# EasyEDA Pro project ActiveMoCapDeck_80mm.eprj

# Schematic ActivaMoCapDeck
Board Name: ActiveMoCapDeck; Create Date: 2024-12-02; Page Name: sch_1; Project Name: ActiveMoCapDeck_10mm; Schematic Name: ActivaMoCapDeck; Update Date: 2024-12-02; Comment1: Licensed under CC-BY 4.0; Comp: Bitcraze AB; Date: 20 okt 2014; File: template; Id: 1/1; Rev: A; Sheet: /; Title: Crazyflie 2.0 expansion boad template
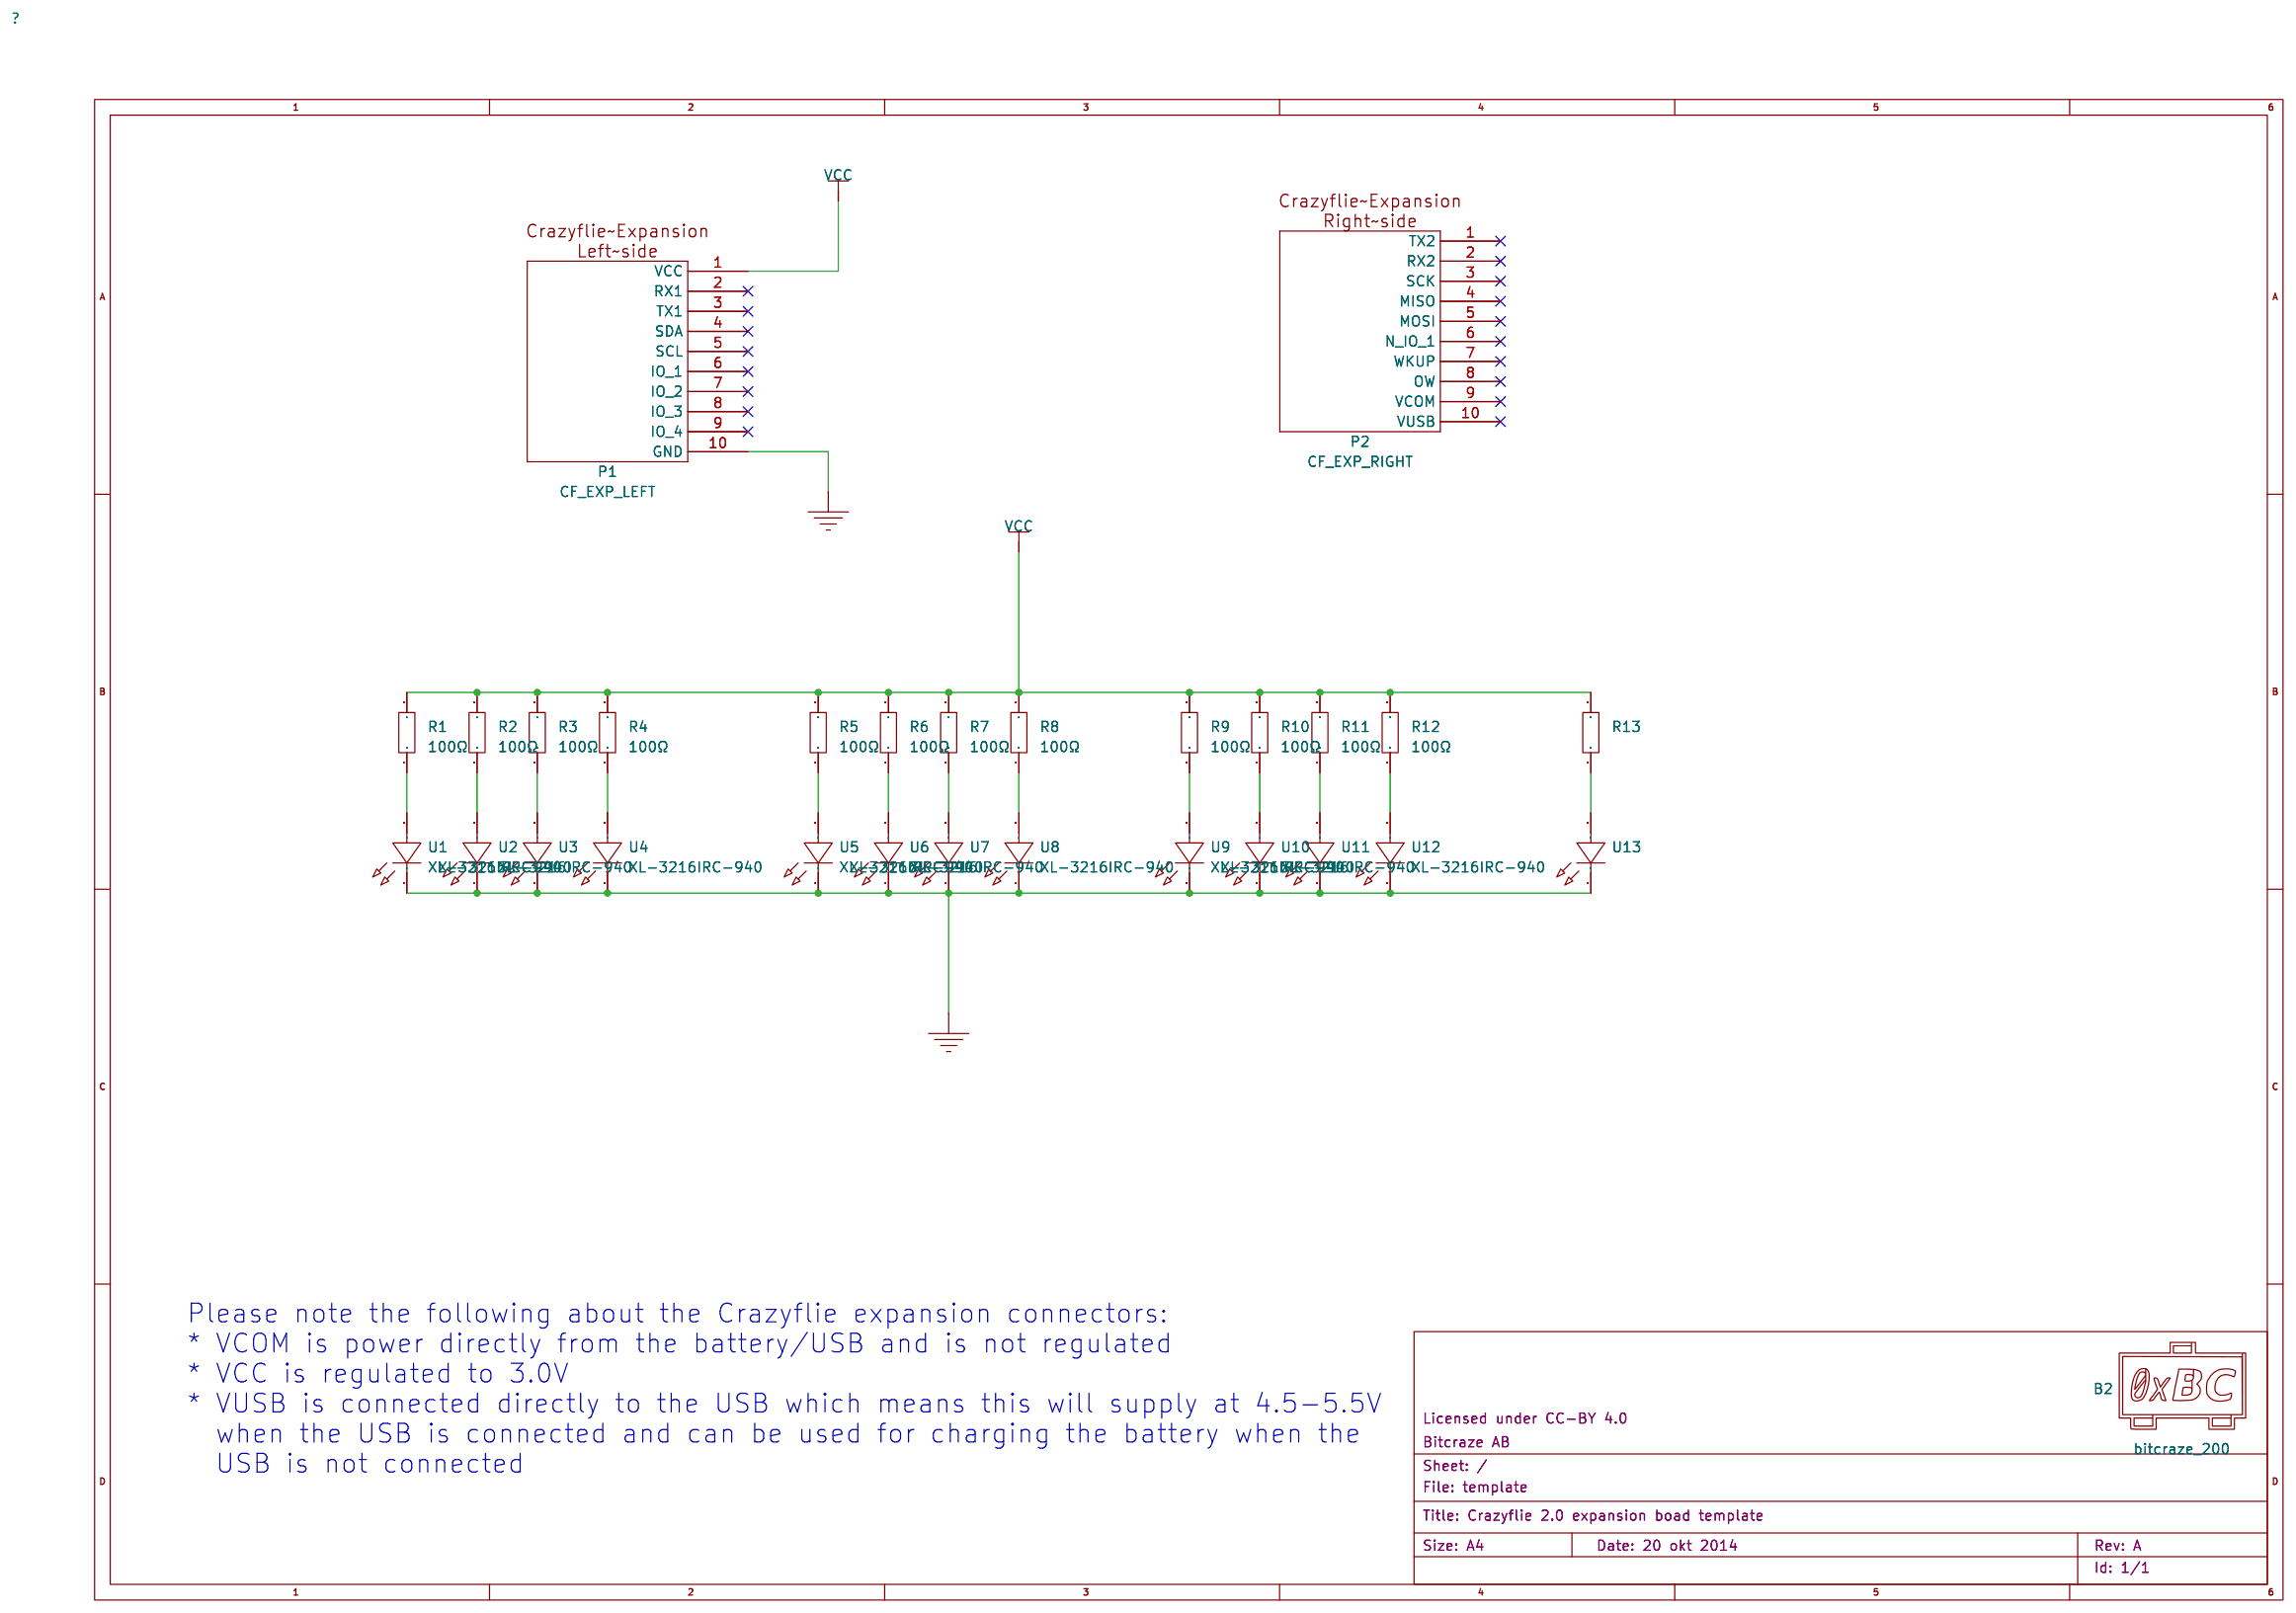
[diagram p0: schematic sheet]

## Parts
B2  bitcraze_200  [bitcraze:EXP_ORIENTATION]
P1  CF_EXP_LEFT  [connectors:BF090-10-X-B2]
P2  CF_EXP_RIGHT  [connectors:BF090-10-X-B2]
R1  100Ω  [R1206]
R2  100Ω  [R1206]
R3  100Ω  [R1206]
R4  100Ω  [R1206]
R5  100Ω  [R1206]
R6  100Ω  [R1206]
R7  100Ω  [R1206]
R8  100Ω  [R1206]
R9  100Ω  [R1206]
R10  100Ω  [R1206]
R11  100Ω  [R1206]
R12  100Ω  [R1206]
R13  100Ω  [R1206]
U1  XL-3216IRC-940  [LED1206-RD]
U2  XL-3216IRC-940  [LED1206-RD]
U3  XL-3216IRC-940  [LED1206-RD]
U4  XL-3216IRC-940  [LED1206-RD]
U5  XL-3216IRC-940  [LED1206-RD]
U6  XL-3216IRC-940  [LED1206-RD]
U7  XL-3216IRC-940  [LED1206-RD]
U8  XL-3216IRC-940  [LED1206-RD]
U9  XL-3216IRC-940  [LED1206-RD]
U10  XL-3216IRC-940  [LED1206-RD]
U11  XL-3216IRC-940  [LED1206-RD]
U12  XL-3216IRC-940  [LED1206-RD]
U13  XL-3216IRC-940  [LED1206-RD]

## Library data of the parts
B2 = bitcraze_200: Check: false
P1 = CF_EXP_LEFT: Library Name: *; Check: false
P2 = CF_EXP_RIGHT: Library Name: *; Check: false
R1-R13 = 1206W4F1000T5E: 电阻类型:厚膜电阻;阻值:100Ω;精度:±1%;功率:250mW;最大工作电压:200V;温度系数:±100ppm/℃;; LCSC Part Name: 100Ω ±1% 250mW 厚膜电阻; Supplier Part: C17901; Manufacturer: UNI-ROYAL(厚声); Supplier Footprint: 1206; JLCPCB Part Class: 基础库; Datasheet: https://atta.szlcsc.com/upload/public/pdf/source/20200306/C422600_1E6D84923E4A46A82E41ADD87F860B5C.pdf; Supplier: LCSC; Type: 厚膜电阻; Tolerance: ±1%; Power(Watts): 250mW; Overload Voltage (Max): 200V; Temperature Coefficient: ±100ppm/℃; Operating Temperature Range: -55℃~+155℃
U1-U13 = XL-3216IRC-940: 正向电压:1.2V~1.6V;耗散功率:70mW;波长:939nm~946nm;辐射强度:-;正向电流-DC (If):30mA;直流反向耐压:5V;视角:120°;; LCSC Part Name: 940nm 30mA红外发射; Supplier Part: C965892; Manufacturer: XINGLIGHT(成兴光); Supplier Footprint: 1206; JLCPCB Part Class: 扩展库; Datasheet: https://atta.szlcsc.com/upload/public/pdf/source/20240218/C8A2B9DDF9B3730036042A306FEBA0C2.pdf; Supplier: LCSC; Vf - Forward Voltage: 1.2V~1.6V; Power Dissipation: 70mW; Wavelength: 939nm~946nm; Current - DC Forward (If): 30mA; Reverse Voltage: 5V; View Angle: 120°; Operating Temperature: -30℃~+85℃

## Nets
GND: P1.10(GND) U1.1(K) U2.1(K) U3.1(K) U4.1(K) U5.1(K) U6.1(K) U7.1(K) U8.1(K) U9.1(K) U10.1(K) U11.1(K) U12.1(K) U13.1(K)
VCC: P1.1(VCC) R1.2 R2.2 R3.2 R4.2 R5.2 R6.2 R7.2 R8.2 R9.2 R10.2 R11.2 R12.2 R13.2
$3N18323: R1.1 U1.2(A)
$3N18400: R2.1 U2.2(A)
$3N18477: R3.1 U3.2(A)
$3N18554: R4.1 U4.2(A)
$3N18856: R5.1 U5.2(A)
$3N18858: R6.1 U6.2(A)
$3N18860: R7.1 U7.2(A)
$3N18862: R8.1 U8.2(A)
$3N19164: R9.1 U9.2(A)
$3N19166: R10.1 U10.2(A)
$3N19168: R11.1 U11.2(A)
$3N19170: R12.1 U12.2(A)
$3N19472: R13.1 U13.2(A)

Not connected (* = marked no-connect by the designer): P1 2(RX1)* 3(TX1)* 4(SDA)* 5(SCL)* 6(IO_1)* 7(IO_2)* 8(IO_3)* 9(IO_4)*; P2 1(TX2)* 2(RX2)* 3(SCK)* 4(MISO)* 5(MOSI)* 6(N_IO_1)* 7(WKUP)* 8(OW)* 9(VCOM)* 10(VUSB)*

## Notes on the sheet
- Please note the following about the Crazyflie expansion connectors:
  * VCOM is power directly from the battery/USB and is not regulated
  * VCC is regulated to 3.0V
  * VUSB is connected directly to the USB which means this will supply at 4.5-5.5V
    when the USB is connected and can be used for charging the battery when the
    USB is not connected

# Board pcb
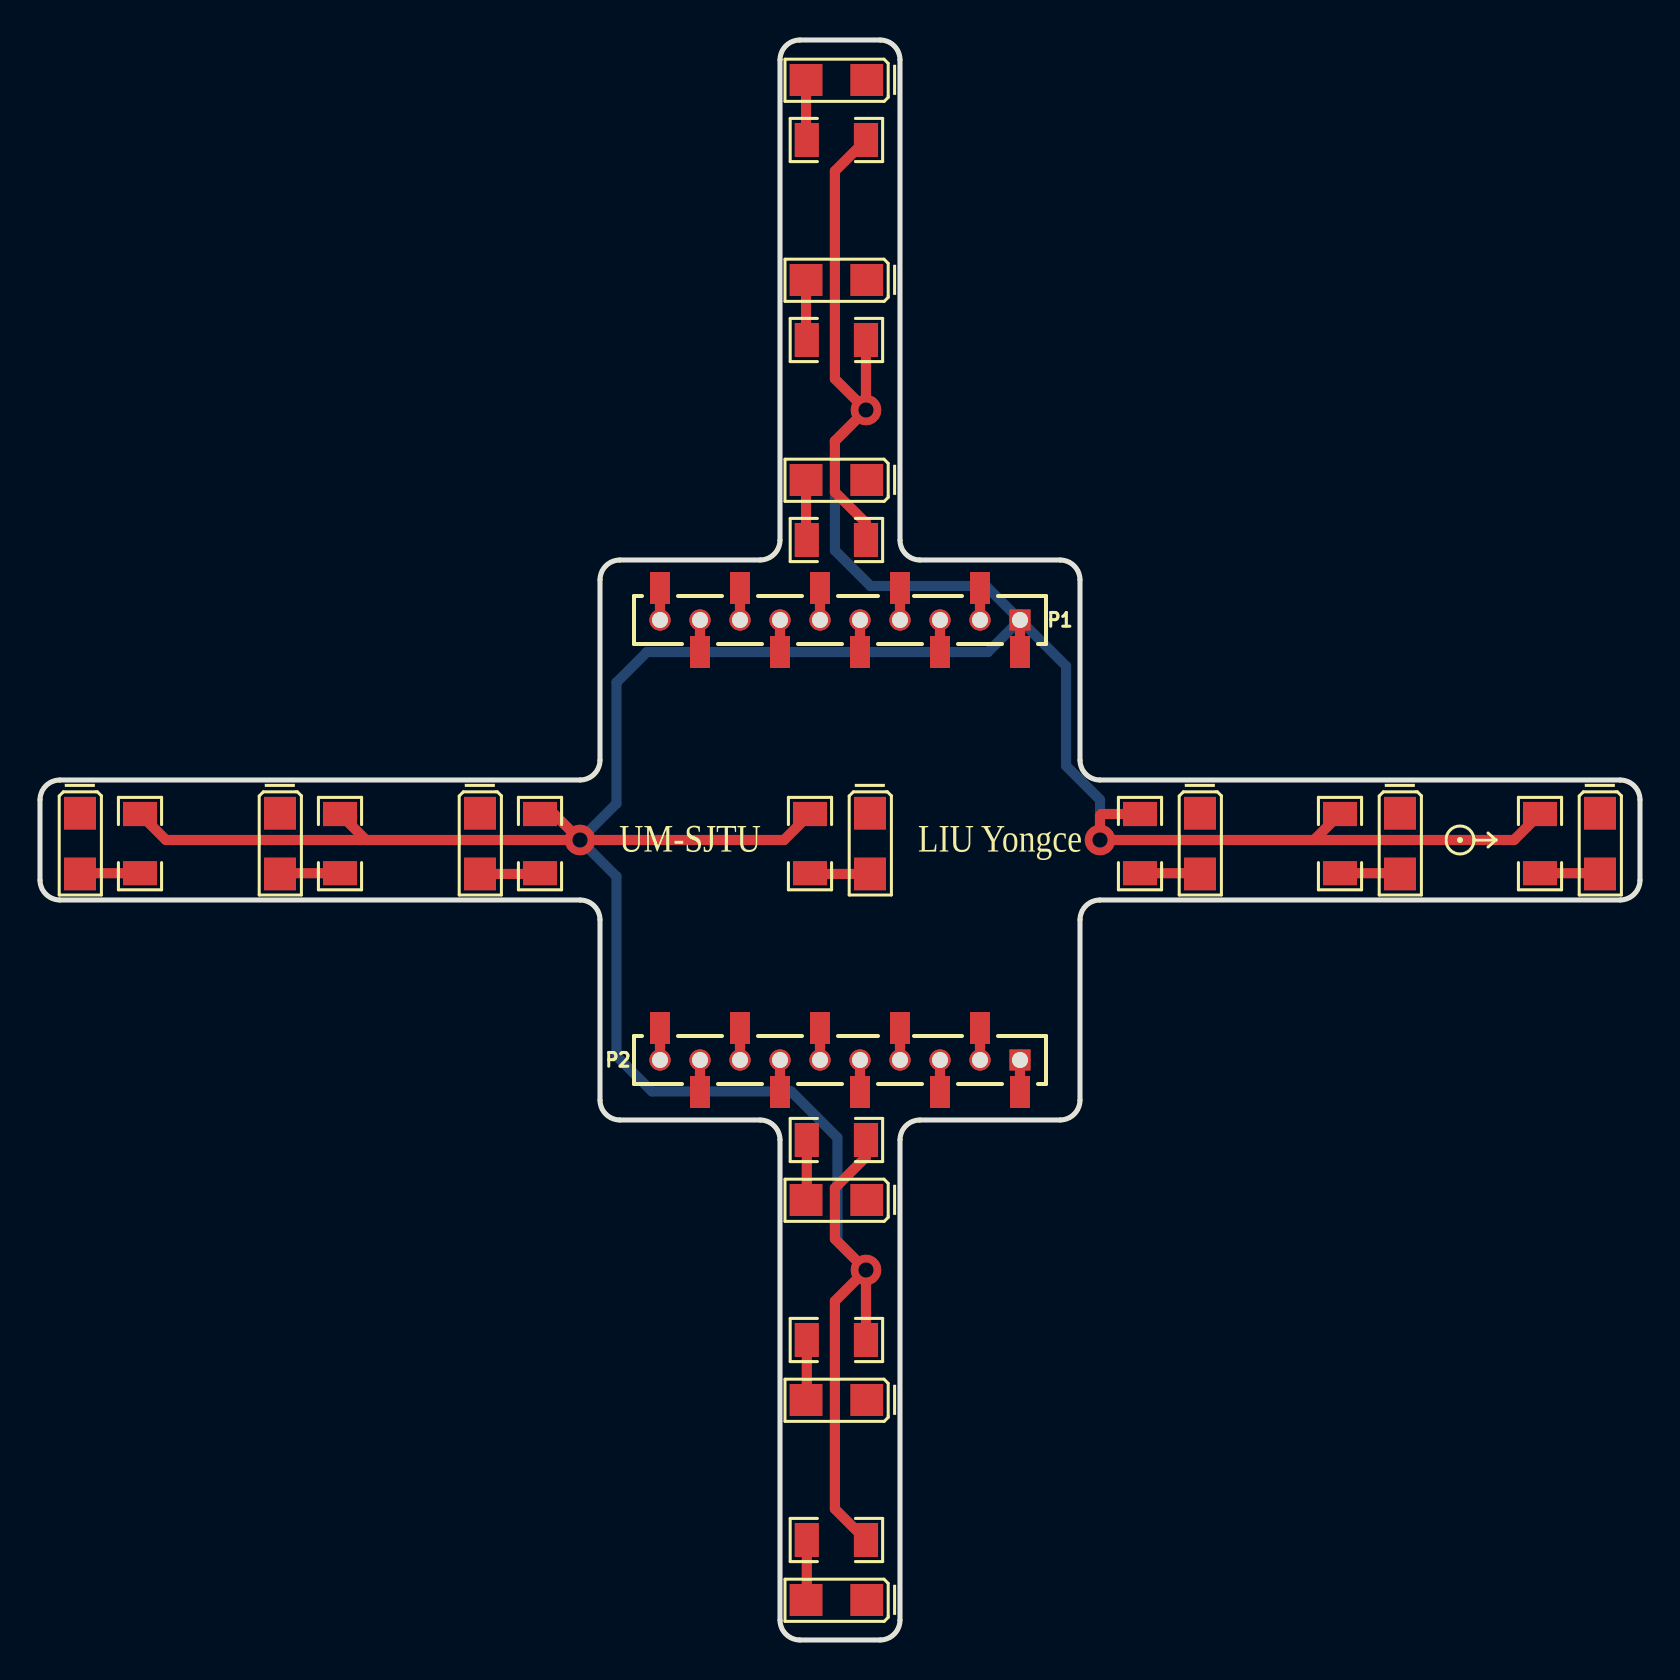
[diagram p1: board, top side]
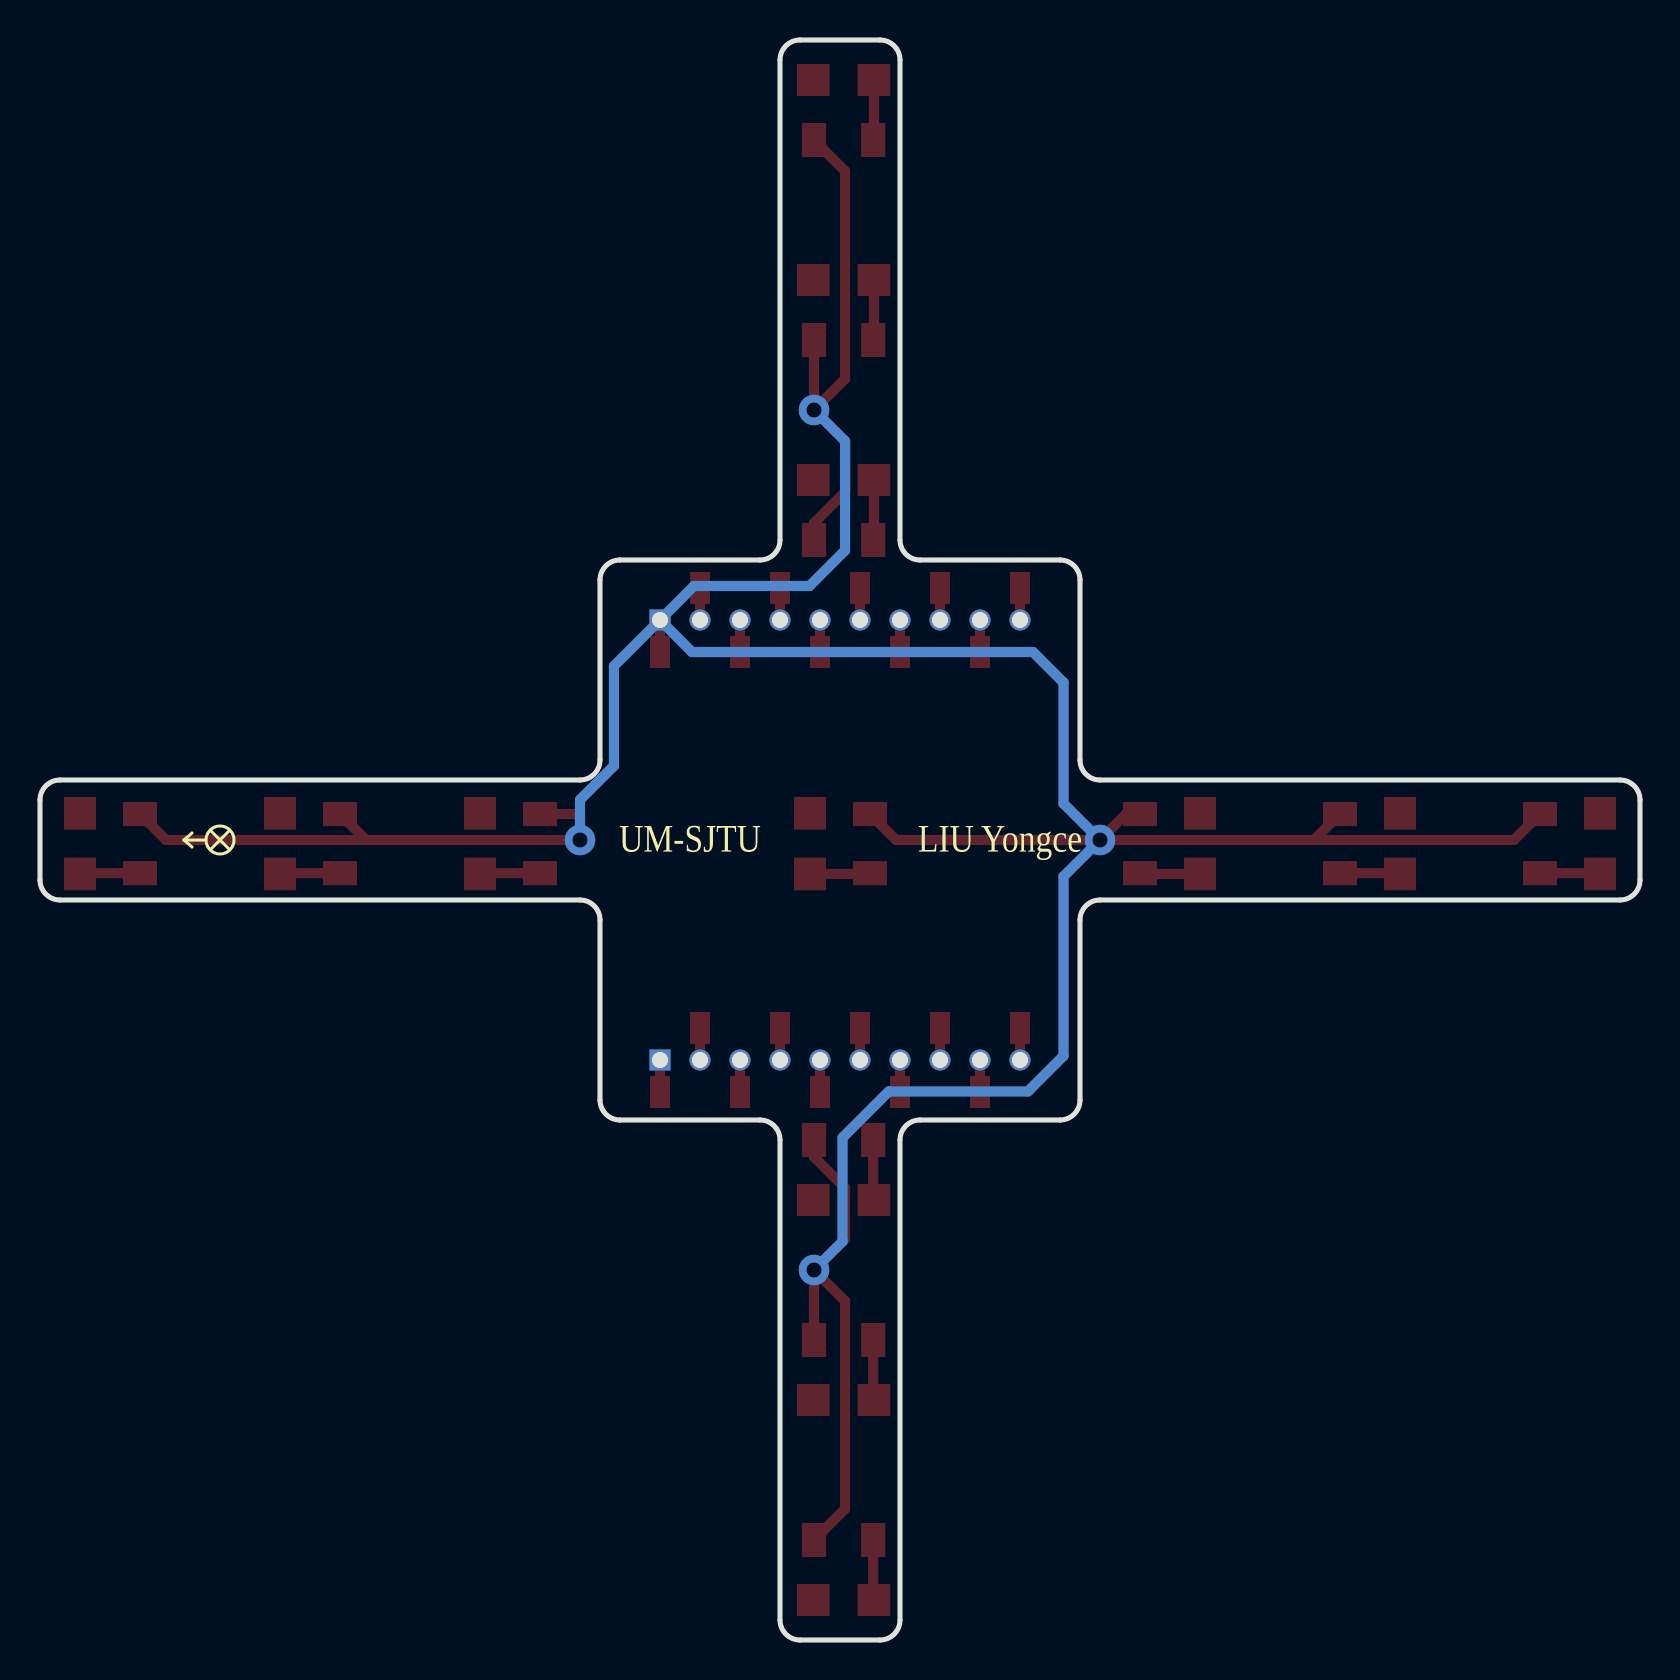
[diagram p2: board, bottom side, seen from below]

Outline 80 x 80 mm; copper layers: Top Layer, Bottom Layer. Coordinates in mm from the lower left corner of the outline.
Outline path: 0,42 arc(0.29,42.71) 1,43 27,43 arc(27.71,43.29) 28,44 28,53 arc(28.29,53.71) 29,54 36,54 arc(36.71,54.29) 37,55 37,79 arc(37.29,79.71) 38,80 42,80 arc(42.71,79.71) 43,79 43,55 arc(43.29,54.29) 44,54 51,54 arc(51.71,53.71) 52,53 52,44 arc(52.29,43.29) 53,43 79,43 arc(79.71,42.71) 80,42 80,38 arc(79.71,37.29) 79,37 53,37 arc(52.29,36.71) 52,36 52,27 arc(51.71,26.29) 51,26 44,26 arc(43.29,25.71) 43,25 43,1 arc(42.71,0.29) 42,0 38,0 arc(37.29,0.29) 37,1 37,25 arc(36.71,25.71) 36,26 29,26 arc(28.29,26.29) 28,27 28,36 arc(27.71,36.71) 27,37 1,37 arc(0.29,37.29) 0,38 0,42
Stack: Top Layer 0.035mm / Dielectric1 1.51mm FR4 er 4.5 / Bottom Layer 0.035mm

## Design rules (mm)
spacing Default (default): track to track 0.152, other pairs 0 to 0.152
track width Default (default): min 0.203, default 0.203, max 2.54
differential pair Default (default): width min 0, default 0, max 2.54; gap min 0, default 0
via Default (default): diameter min 0.635, default 0.635, max 10.003; hole min 0.381, default 0.381, max 5.999

## Placement (name value [footprint] x y rotation side)
B2  bitcraze_200  [bitcraze:EXP_ORIENTATION]  71 40 0 top
P1  CF_EXP_LEFT  [connectors:BF090-10-X-B2]  40 51 180 top
P2  CF_EXP_RIGHT  [connectors:BF090-10-X-B2]  40 29 180 top
R1  100Ω  [R1206]  75 39.82 90 top
R2  100Ω  [R1206]  65 39.82 90 top
R3  100Ω  [R1206]  55 39.82 90 top
R4  100Ω  [R1206]  39.82 5 0 top
R5  100Ω  [R1206]  39.82 15 0 top
R6  100Ω  [R1206]  39.82 25 0 top
R7  100Ω  [R1206]  5 39.82 90 top
R8  100Ω  [R1206]  15 39.82 90 top
R9  100Ω  [R1206]  25 39.82 90 top
R10  100Ω  [R1206]  39.82 75 0 top
R11  100Ω  [R1206]  39.82 65 0 top
R12  100Ω  [R1206]  39.82 55 0 top
R13  100Ω  [R1206]  38.5 39.82 90 top
U1  XL-3216IRC-940  [LED1206-RD]  78 39.82 270 top
U2  XL-3216IRC-940  [LED1206-RD]  68 39.82 270 top
U3  XL-3216IRC-940  [LED1206-RD]  58 39.82 270 top
U4  XL-3216IRC-940  [LED1206-RD]  39.82 2 180 top
U5  XL-3216IRC-940  [LED1206-RD]  39.82 12 180 top
U6  XL-3216IRC-940  [LED1206-RD]  39.82 22 180 top
U7  XL-3216IRC-940  [LED1206-RD]  2 39.82 270 top
U8  XL-3216IRC-940  [LED1206-RD]  12 39.82 270 top
U9  XL-3216IRC-940  [LED1206-RD]  22 39.82 270 top
U10  XL-3216IRC-940  [LED1206-RD]  39.82 78 180 top
U11  XL-3216IRC-940  [LED1206-RD]  39.82 68 180 top
U12  XL-3216IRC-940  [LED1206-RD]  39.82 58 180 top
U13  XL-3216IRC-940  [LED1206-RD]  41.5 39.82 270 top

## Footprints (pads in the part's own frame, mm; a bottom-side part is the same pattern mirrored in y, then rotated)
connectors:BF090-10-X-B2
  rect 1x1.6 smd: 1(-9,1.6) 2(-7,-1.6) 3(-5,1.6) 4(-3,-1.6) 5(-1,1.6) 6(1,-1.6) 7(3,1.6) 8(5,-1.6) 9(7,1.6) 10(9,-1.6)
  round 1.05 smd: 1(-9,0) 2(-7,0) 3(-5,0) 4(-3,0) 5(-1,0) 6(1,0) 7(3,0) 8(5,0) 9(7,0) 10(9,0)
  rect 1.05x1.05 hole 0.8: 1(-9,0)
  round 1.05 hole 0.8: 2(-7,0) 3(-5,0) 4(-3,0) 5(-1,0) 6(1,0) 7(3,0) 8(5,0) 9(7,0) 10(9,0)
LED1206-RD
  rect 1.635x1.6 smd: 1(-1.518,0) 2(1.518,0)
R1206
  rect 1.208x1.701 smd: 1(-1.479,0) 2(1.479,0)

## Nets
As in the schematic.

Pads without a net: P1 2 3 4 5 6 7 8 9; P2 1 2 3 4 5 6 7 8 9 10

## Via types
v1: diameter 1.524, hole 0.762, Top Layer to Bottom Layer, 4 vias

## Routing (per net, layer and track width the routed paths; a pad name or vN(x,y) marks a point on that pad's centre or on a via; arc(x,y) is an arc through that point)
GND: length 1.6
  Top Layer w0.508: P1.10 P1.10
VCC: length 212.9
  Top Layer w0.508: R4.2 39.75,6.55 39.75,16.95 v1(41.3,18.5) ; 75,41.3 73.7,40 63.7,40 ; 38.5,41.3 37.2,40 v1(27,40) ; 16.3,40 6.3,40 5,41.3 ; 16.3,40 v1(27,40) ; 16.3,40 15,41.3 ; P1.1 P1.1 ; R10.2 39.75,73.45 39.75,63.05 v1(41.3,61.5) ; 25,41.3 25.7,41.3 v1(27,40) ; v1(41.3,61.5) R11.2 ; v1(41.3,61.5) 39.75,59.95 39.75,57.4 41.3,55.85 R12.2 ; 55,41.3 53.07,41.3 53,41.22 v1(53,40) 63.7,40 ; R5.2 v1(41.3,18.5) ; v1(41.3,18.5) 39.75,20.05 39.75,22.6 41.3,24.15 R6.2 ; 63.7,40 65,41.3
  Bottom Layer w0.508: P1.1 51.3,48.7 51.3,43.71 53,42.01 v1(53,40) ; P1.1 47.3,52.7 41.52,52.7 39.75,54.48 39.75,59.95 v1(41.3,61.5) ; P1.1 47.4,49.4 30.35,49.4 28.82,47.87 28.82,41.82 v1(27,40) 28.82,38.18 28.82,29.2 30.6,27.43 37.56,27.43 39.87,25.11 39.87,19.93 v1(41.3,18.5)
(no net): length 28.8
  Top Layer w0.508: P2.9 P2.9 ; P1.5 P1.5 ; P2.3 P2.3 ; P2.8 P2.8 ; P1.6 P1.6 ; P2.10 P2.10 ; P2.6 P2.6 ; P1.9 P1.9 ; P2.7 P2.7 ; P1.7 P1.7 ; P2.5 P2.5 ; P1.4 P1.4 ; P2.4 P2.4 ; P2.1 P2.1 ; P1.8 P1.8 ; P1.3 P1.3 ; P1.2 P1.2 ; P2.2 P2.2
$3N18323: length 3
  Top Layer w0.508: R1.1 77.96,38.34 U1.2
$3N18400: length 3
  Top Layer w0.508: R2.1 67.96,38.34 U2.2
$3N18477: length 3
  Top Layer w0.508: R3.1 57.96,38.34 U3.2
$3N18554: length 3
  Top Layer w0.508: R4.1 38.34,2.04 U4.2
$3N18856: length 3
  Top Layer w0.508: U5.2 38.34,12.04 R5.1
$3N18858: length 3
  Top Layer w0.508: U6.2 38.34,22.04 R6.1
$3N18860: length 3
  Top Layer w0.508: U7.2 2.04,38.34 R7.1
$3N18862: length 3
  Top Layer w0.508: U8.2 12.04,38.34 R8.1
$3N19164: length 3
  Top Layer w0.508: U9.2 24.96,38.3 R9.1
$3N19166: length 3
  Top Layer w0.508: U10.2 38.3,75.04 R10.1
$3N19168: length 3
  Top Layer w0.508: U11.2 38.3,65.04 R11.1
$3N19170: length 3
  Top Layer w0.508: U12.2 38.3,55.04 R12.1
$3N19472: length 3
  Top Layer w0.508: U13.2 38.54,38.3 R13.1

## Copper pours and planes (outline as drawn; the poured copper is in the pictures)
GND on Top Layer: -1.53,81.02 81.47,81.02 81.47,-1.98 -1.53,-1.98
GND on Bottom Layer: -0.57,81.78 82.93,81.78 82.93,-1.72 -0.57,-1.72

## Text on the board
Bottom Silkscreen Layer: LIU Yongce | UM-SJTU
Document Layer: M1 | M4 | M3 | M2 | ANT | Crazyflie 2.0 | uUSB / TOP | BAT | SWD / BOTTOM | BTN | Bitcraze
Top Silkscreen Layer: UM-SJTU | LIU Yongce
